# EAGLE design Seeeduino v4.0 (EAGLE 6.4)

## Sheet 1 of 2
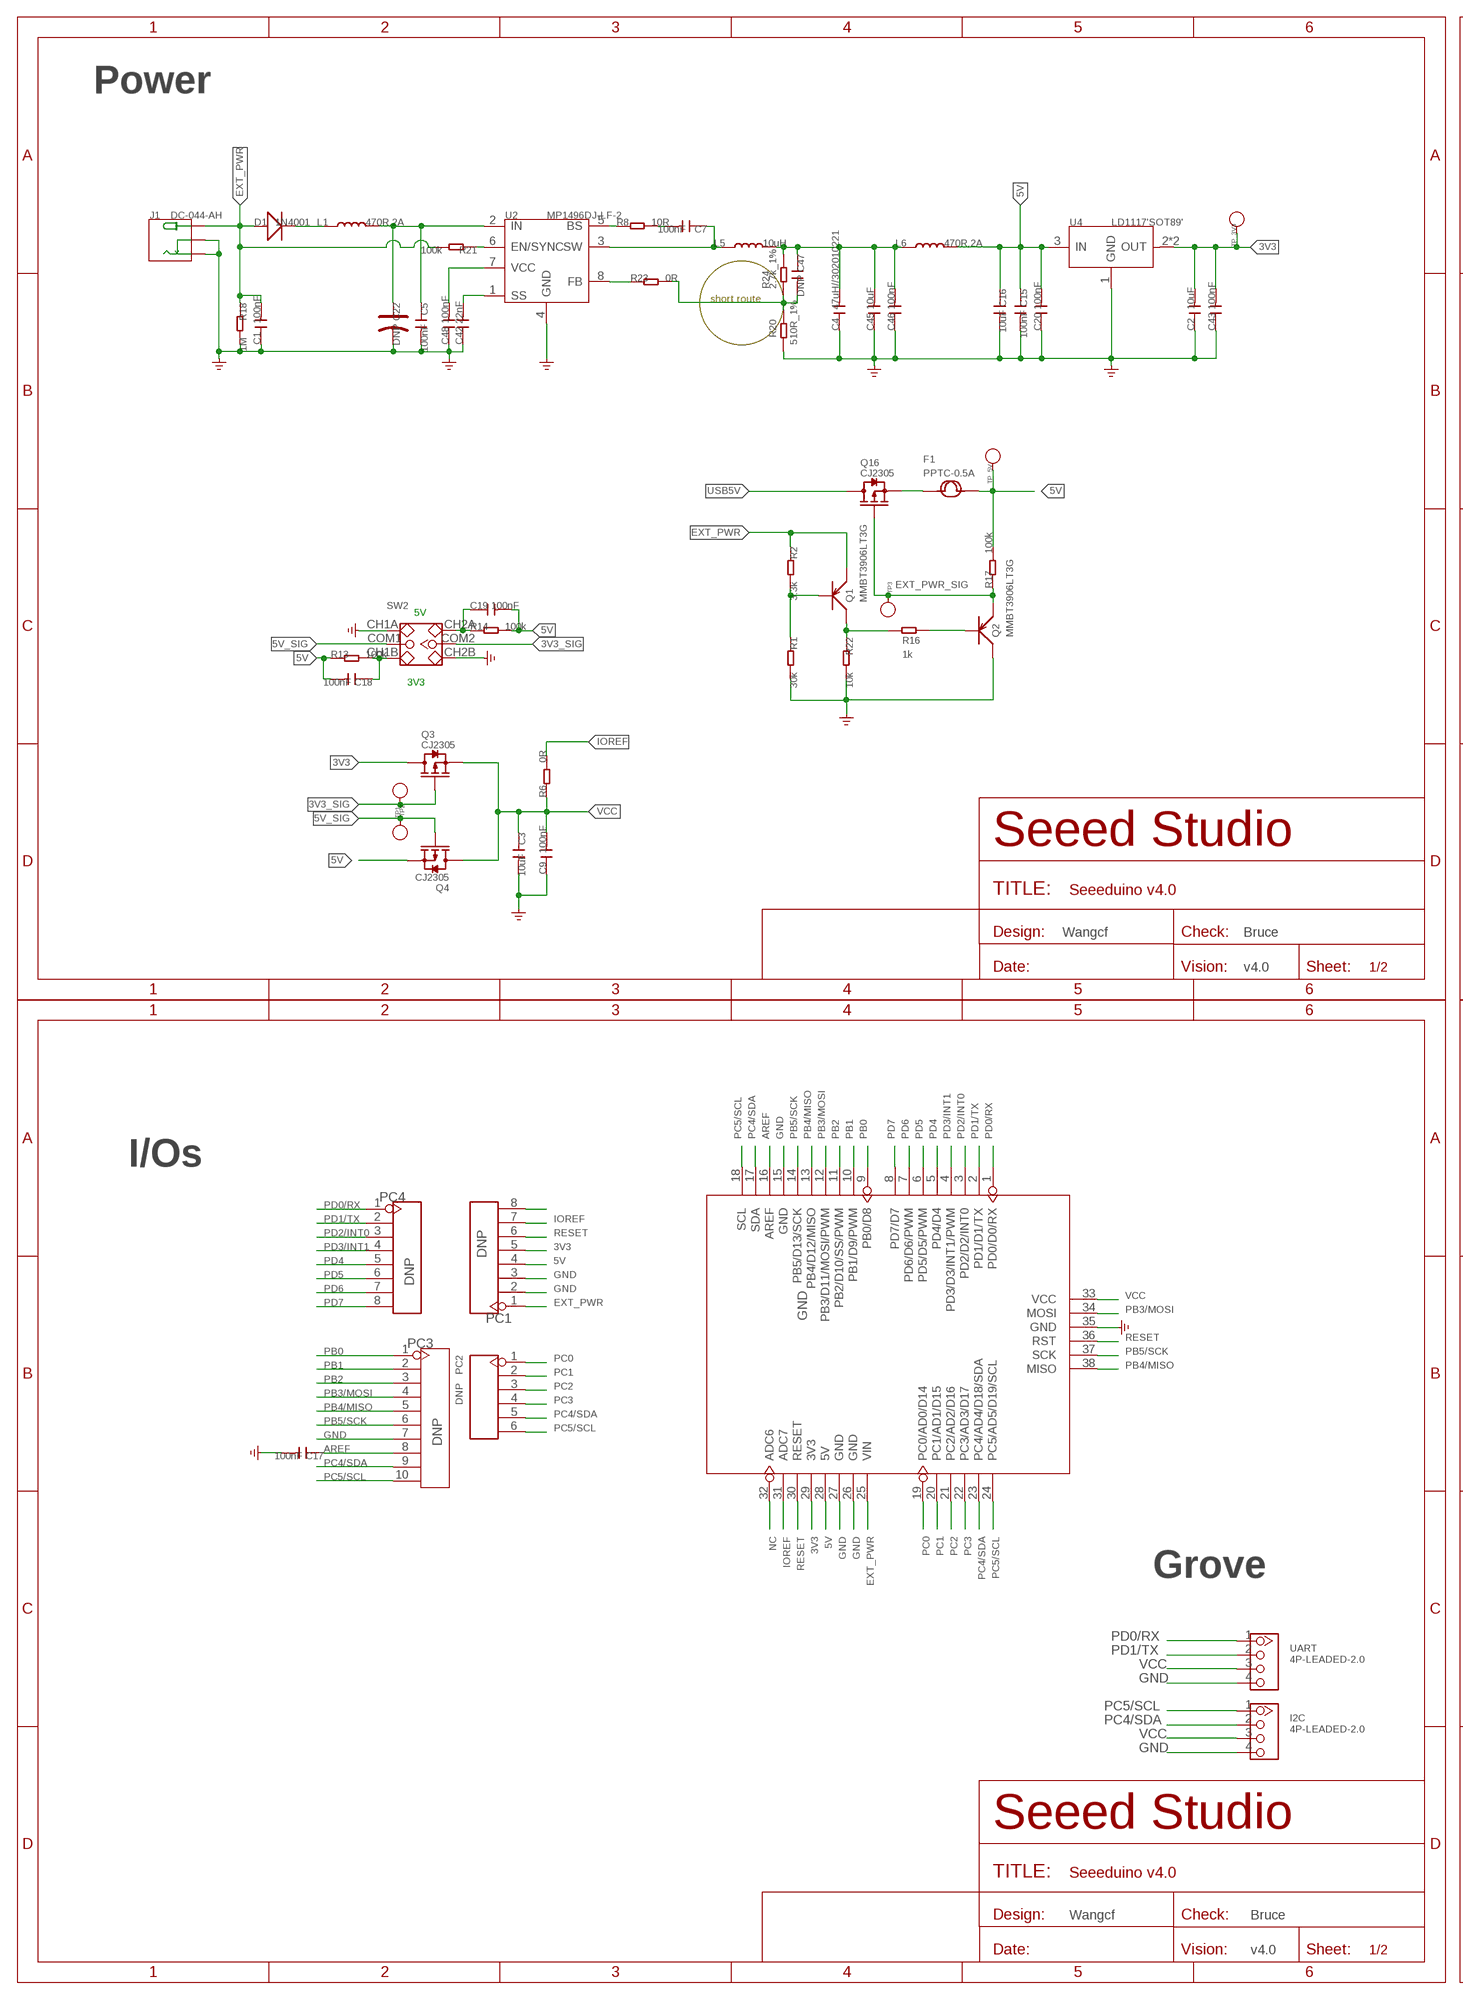
[diagram p0: schematic, sheet 1, part 1 of 2]
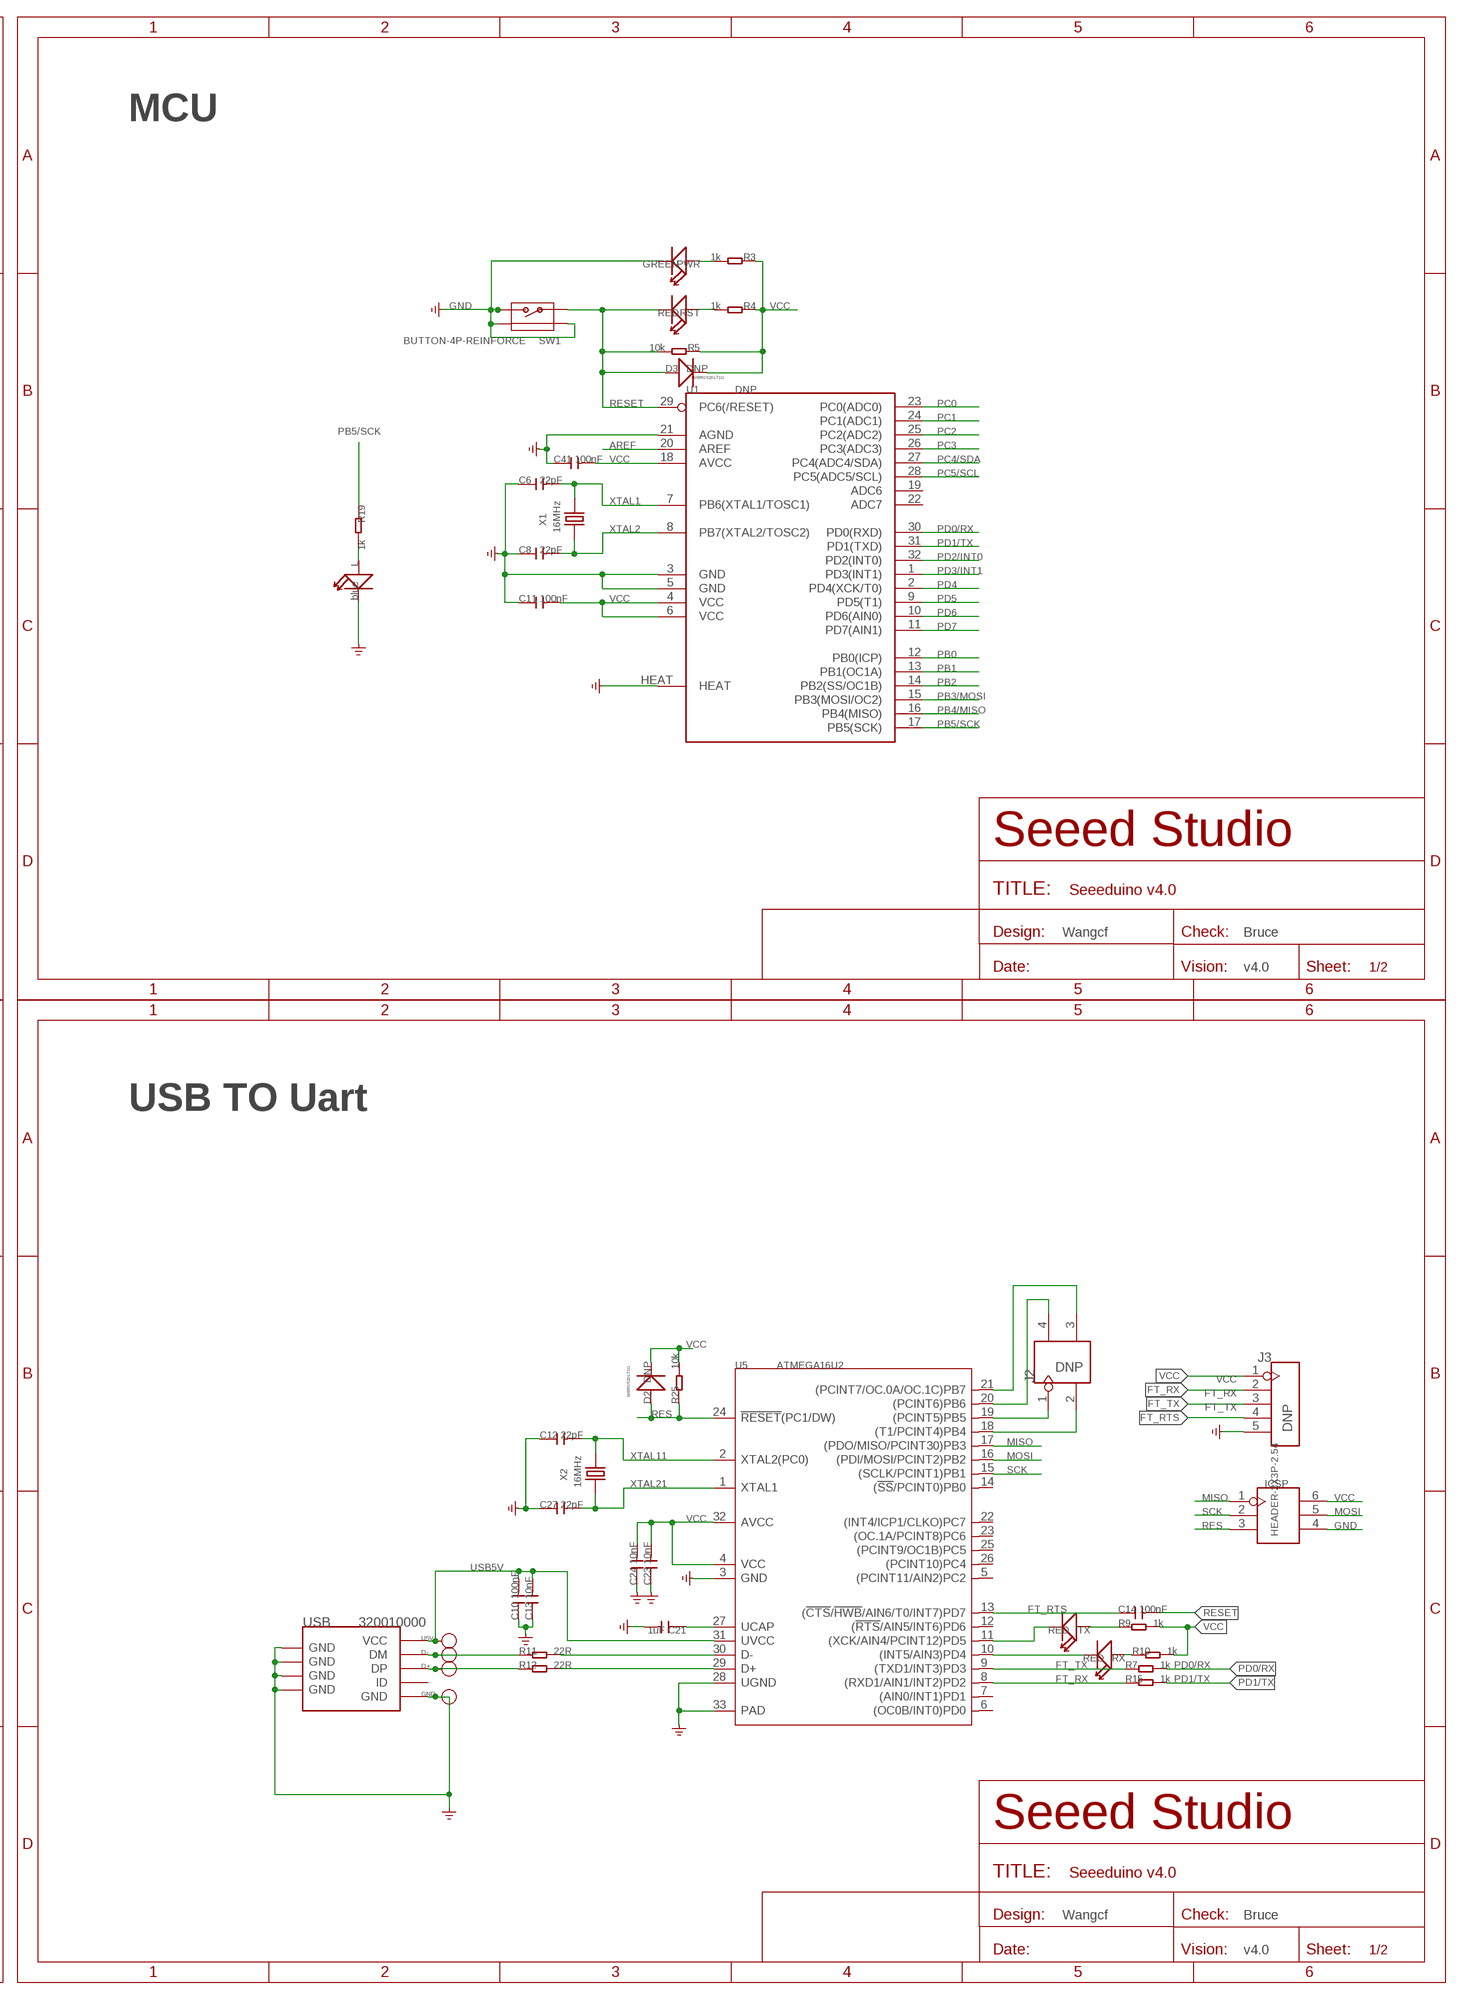
[diagram p1: schematic, sheet 1, part 2 of 2]

### Parts
C1  100nF  C-0603  [C0603]
C2  10uF  C-0805  [C0805]
C3  10uF  C-0805  [C0805]
C4  47uH//302010221  C-1206  [C1206]
C5  100nF  C-0603  [C0603]
C6  22pF  C-0603  [C0603]
C7  100nF  C-0603  [C0603]
C8  22pF  C-0603  [C0603]
C9  100nF  C-0603  [C0603]
C10  100nF  C-0603  [C0603]
C11  100nF  C-0603  [C0603]
C12  22pF  C-0603  [C0603]
C13  10nF  C-0603  [C0603]
C14  100nF  C-0603  [C0603]
C15  100nF  C-0603  [C0603]
C16  10uF  C-0805  [C0805]
C17  100nF  C-0603  [C0603]
C18  100nF  C-0603  [C0603]
C19  100nF  C-0603  [C0603]
C20  100nF  C-0603  [C0603]
C21  1uF  C-0603  [C0603]
C22  DNP  CAP-AVX-B  [AVX-B]
C23  10nF  C-0603  [C0603]
C24  10nF  C-0603  [C0603]
C27  22pF  C-0603  [C0603]
C41  100nF  C-0603  [C0603]
C42  22nF  C-0603  [C0603]
C43  100nF  C-0603  [C0603]
C45  10uF  C-0805  [C0805]
C46  100nF  C-0603  [C0603]
C47  DNP  C-0603  [C0603]
C48  100nF  C-0603  [C0603]
D1  1N4001  D'DO-214AC'  [D2010]
D2  DNP  D'1206'  [SOD123]
D3  DNP  D'1206'  [SOD123]
D+  PAD-TEST-POINT'4545'  [TP_4545]
D-  PAD-TEST-POINT'4545'  [TP_4545]
F1  PPTC-0.5A  FUSE'1206'  [F1206]
GND  PAD-TEST-POINT'4545'  [TP_4545]
I2C  4P-LEADED-2.0  TWIG-2.0-LEADED  [4P-LEADED-2.0]
ICSP  HEADER-2X3P-2.54  HEADER-2X3P-2.0  [2X3P-2.0]
J1  DC-044-AH  DC-044  [DC-404]
J2  DNP  HEADER-2X2P-2.54  [2X2P-2.54]
J3  DNP  HEADER-5P-2.54  [5P-2.54]
L  blue  LED'0603'  [LED-0603]
L1  470R,2A  L'0805'  [L0805]
L5  10uH  L'1813'  [1813]
L6  470R,2A  L'0805'  [L0805]
PC1  DNP  HEADER-8P-2.54  [8P-2.54]
PC2  DNP  HEADER-6P-65/35MIL  [6P-2.54-65/35MIL]
PC3  DNP  HEADER-10P-2.54  [10P-2.54]
PC4  DNP  HEADER-8P-2.54  [8P-2.54]
PWR  GREEN  LED'0603'  [LED-0603]
Q1  MMBT3906LT3G  TRANSISTOR-PNP-SOT23  [SOT23]
Q2  MMBT3906LT3G  TRANSISTOR-PNP-SOT23  [SOT23]
Q3  CJ2305  MOSFET-P'SI2323CDS/SI2305DS<BR>'  [SOT23]
Q4  CJ2305  MOSFET-P'SI2323CDS/SI2305DS<BR>'  [SOT23]
Q16  CJ2305  MOSFET-P'SI2323CDS/SI2305DS<BR>'  [SOT23]
R1  30k  R-0603  [R0603]
R2  3.3k  R-0603  [R0603]
R3  1k  R-0603  [R0603]
R4  1k  R-0603  [R0603]
R5  10k  R-0603  [R0603]
R6  0R  R-0603  [R0603]
R7  1k  R-0603  [R0603]
R8  10R  R-0603  [R0603]
R9  1k  R-0603  [R0603]
R10  1k  R-0603  [R0603]
R11  22R  R-0603  [R0603]
R12  22R  R-0603  [R0603]
R13  100k  R-0603  [R0603]
R14  100k  R-0603  [R0603]
R15  1k  R-0603  [R0603]
R16  1k  R-0603  [R0603]
R17  100k  R-0603  [R0603]
R18  1M  R-0603  [R0603]
R19  1k  R-0603  [R0603]
R20  510R_1%  R-0603  [R0603]
R21  100k  R-0603  [R0603]
R22  10k  R-0603  [R0603]
R23  0R  R-0603  [R0603]
R24  2.7k_1%  R-0603  [R0603]
R25  10k  R-0603  [R0603]
RST  RED  LED'0603'  [LED-0603]
RX  RED  LED'0603'  [LED-0603]
SW1  BUTTON-4P-REINFORCE  BUTTON-4P-REINFORCE'TS-1188E'  [4P-SMD-7X3.5X3.5H]
SW2  SWITCH-2CH-6P-2.54  SWITCH-2CH-6P-SMD  [6P-SMD-2CH-2.54-3.5X7.2]
TP1  PAD-TEST-POINT'4545'  [TP_4545]
TP2  PAD-TEST-POINT'4545'  [TP_4545]
TP3  PAD-TEST-POINT'4545'  [TP_4545]
TP_3V3  PAD-TEST-POINT'4545'  [TP_4545]
TP_5V  PAD-TEST-POINT'4545'  [TP_4545]
TX  RED  LED'0603'  [LED-0603]
U1  DNP  MEGA8  [MLF32X]
U2  MP1496DJ-LF-2  MP1496DJ  [TSOT23-8]
U3  ARDUINO-38P  [ARDUINO-38P]
U4  LD1117'SOT89'  [SOT89]
U5  ATMEGA16U2  [QFN32]
U5V  PAD-TEST-POINT'4545'  [TP_4545]
UART  4P-LEADED-2.0  TWIG-2.0-LEADED  [4P-LEADED-2.0]
USB  320010000  USB-MINIUSB-5P-MICRO  [MICRO-USB]
X1  16MHz  CRYSTAL'5032'  [2P-SMD-5X3.2]
X2  16MHz  CRYSTAL'5032'  [2P-SMD-5X3.2]

### Nets
3V3: C2.2 C43.2 PC1.5 Q3.3(D) TP_3V3.T U3.29(3V3) U4.2(OUT) U4.4(OUT)
3V3_SIG: Q3.1(G) SW2.COM2 TP1.T
5V: C15.1 C16.1 C18.2 C19.2 C20.2 F1.2 L6.2 PC1.4 Q4.2(S) R13.1 R14.2 R17.2 TP_5V.T U3.28(5V) U4.3(IN)
5V_SIG: Q4.1(G) SW2.COM1 TP2.T
AREF: C17.1 PC3.8 U1.20(AREF) U3.16(AREF)
D+: D+.T R12.1 USB.3(DP)
D-: D-.T R11.1 USB.2(DM)
EXT_PWR: C1.2 D1.+ J1.+ PC1.1 Q1.2(E) R2.1 R18.1 R21.2 U3.25(VIN)
EXT_PWR_SIG: Q2.2(E) Q16.1(G) R17.1 TP3.T
FT_RTS: C14.1 J3.4 U5.13((!CTS!/!HWB!/AIN6/T0/INT7)PD7)
FT_RX: J3.2 R15.1 U5.8((RXD1/AIN1/INT2)PD2)
FT_TX: J3.3 R7.1 U5.9((TXD1/INT3)PD3)
GND: C1.1 C2.1 C3.2 C4.1 C5.2 C6.1 C8.1 C9.1 C10.1 C11.1 C12.1 C13.1 C15.2 C16.2 C17.2 C20.1 C21.2 C22.- C23.1 C24.1 C27.1 C41.1 C42.1 C43.1 C45.1 C46.1 C48.1 GND.T I2C.4 ICSP.4 J1.- J1.CDN J3.5 L.- PC1.2 PC1.3 PC3.7 PWR.- Q2.3(C) R1.2 R18.2 R20.1 R22.2 SW1.2 SW1.S1 SW1.S2 SW2.CH1A SW2.CH2B U1.3(GND) U1.5(GND) U1.21(AGND) U1.HEAT U2.4(GND) U3.15(GND) U3.26(GND) U3.27(GND) U3.35(GND) U4.1(GND) U5.3(GND) U5.28(UGND) U5.33(PAD) UART.4 USB.5(GND) USB.S1(GND) USB.S2(GND) USB.S3(GND) USB.S4(GND) USB.S5(GND) USB.S6(GND)
IOREF: PC1.7 R6.2 U3.31(ADC7)
MISO: ICSP.1 U5.17((PDO/MISO/PCINT30)PB3)
MOSI: ICSP.5 U5.16((PDI/MOSI/PCINT2)PB2)
N$1: TX.- U5.11((XCK/AIN4/PCINT12)PD5)
N$3: L.+ R19.2
N$5: Q1.1(B) R1.1 R2.2
N$6: R11.2 U5.30(D-)
N$7: PWR.+ R3.2
N$8: Q2.1(B) R16.2
N$9: Q1.3(C) R16.1 R22.1
N$10: D1.- L1.1
N$11: C18.1 R13.2 SW2.CH1B
N$12: R10.1 RX.+
N$13: R12.2 U5.29(D+)
N$14: RX.- U5.10((INT5/AIN3)PD4)
N$15: C19.1 R14.1 SW2.CH2A
N$16: J2.1 U5.19((PCINT5)PB5)
N$17: R4.2 RST.+
N$18: C21.1 U5.27(UCAP)
N$19: R21.1 U2.6(EN/SYNC)
N$20: C48.2 U2.7(VCC)
N$21: C42.2 U2.1(SS)
N$22: R8.1 U2.5(BS)
N$23: C7.1 L5.1 U2.3(SW)
N$24: C7.2 R8.2
N$25: R23.1 U2.8(FB)
N$26: J2.2 U5.18((T1/PCINT4)PB4)
N$27: C47.2 R20.2 R23.2 R24.2
N$28: J2.4 U5.20((PCINT6)PB6)
N$29: J2.3 U5.21((PCINT7/OC.0A/OC.1C)PB7)
N$32: R9.1 TX.+
NC: PC1.8 U3.32(ADC6)
OUT1: C4.2 C45.2 C46.2 C47.1 L5.2 L6.1 R24.1
P5V [usbvcc]: F1.1 Q16.2(S)
PB0: PC3.1 U1.12(PB0(ICP)) U3.9(PB0/D8)
PB1: PC3.2 U1.13(PB1(OC1A)) U3.10(PB1/D9/PWM)
PB2: PC3.3 U1.14(PB2(SS/OC1B)) U3.11(PB2/D10/SS/PWM)
PB3/MOSI: PC3.4 U1.15(PB3(MOSI/OC2)) U3.12(PB3/D11/MOSI/PWM) U3.34(MOSI)
PB4/MISO: PC3.5 U1.16(PB4(MISO)) U3.13(PB4/D12/MISO) U3.38(MISO)
PB5/SCK: PC3.6 R19.1 U1.17(PB5(SCK)) U3.14(PB5/D13/SCK) U3.37(SCK)
PC0: PC2.1 U1.23(PC0(ADC0)) U3.19(PC0/AD0/D14)
PC1: PC2.2 U1.24(PC1(ADC1)) U3.20(PC1/AD1/D15)
PC2: PC2.3 U1.25(PC2(ADC2)) U3.21(PC2/AD2/D16)
PC3: PC2.4 U1.26(PC3(ADC3)) U3.22(PC3/AD3/D17)
PC4/SDA: I2C.2 PC2.5 PC3.9 U1.27(PC4(ADC4/SDA)) U3.17(SDA) U3.23(PC4/AD4/D18/SDA)
PC5/SCL: I2C.1 PC2.6 PC3.10 U1.28(PC5(ADC5/SCL)) U3.18(SCL) U3.24(PC5/AD5/D19/SCL)
PD0/RX: PC4.1 R7.2 U1.30(PD0(RXD)) U3.1(PD0/D0/RX) UART.1
PD1/TX: PC4.2 R15.2 U1.31(PD1(TXD)) U3.2(PD1/D1/TX) UART.2
PD2/INT0: PC4.3 U1.32(PD2(INT0)) U3.3(PD2/D2/INT0)
PD3/INT1: PC4.4 U1.1(PD3(INT1)) U3.4(PD3/D3/INT1/PWM)
PD4: PC4.5 U1.2(PD4(XCK/T0)) U3.5(PD4/D4)
PD5: PC4.6 U1.9(PD5(T1)) U3.6(PD5/D5/PWM)
PD6: PC4.7 U1.10(PD6(AIN0)) U3.7(PD6/D6/PWM)
PD7: PC4.8 U1.11(PD7(AIN1)) U3.8(PD7/D7)
PWR_IN: C5.1 C22.+ L1.2 U2.2(IN)
RES: D2.+ ICSP.3 R25.1 U5.24(!RESET!(PC1/DW))
RESET: C14.2 D3.+ PC1.6 R5.2 RST.- SW1.1 U1.29(PC6(/RESET)) U3.30(RESET) U3.36(RST)
SCK: ICSP.2 U5.15((SCLK/PCINT1)PB1)
USB5V: C10.2 C13.2 Q16.3(D) U5.31(UVCC) U5V.T USB.1(VCC)
VCC: C3.1 C9.2 C11.2 C23.2 C24.2 C41.2 D2.- D3.- I2C.3 ICSP.6 J3.1 Q3.2(S) Q4.3(D) R3.1 R4.1 R5.1 R6.1 R9.2 R10.2 R25.2 U1.4(VCC) U1.6(VCC) U1.18(AVCC) U3.33(VCC) U5.4(VCC) U5.32(AVCC) UART.3
XTAL1: C6.2 U1.7(PB6(XTAL1/TOSC1)) X1.2
XTAL2: C8.2 U1.8(PB7(XTAL2/TOSC2)) X1.1
XTAL11: C12.2 U5.2(XTAL2(PC0)) X2.2
XTAL21: C27.2 U5.1(XTAL1) X2.1
Unconnected: U1.19(ADC6) U1.22(ADC7) U5.5((PCINT11/AIN2)PC2) U5.6((OC0B/INT0)PD0) U5.7((AIN0/INT1)PD1) U5.12((!RTS!/AIN5/INT6)PD6) U5.14((!SS!/PCINT0)PB0) U5.22((INT4/ICP1/CLKO)PC7) U5.23((OC.1A/PCINT8)PC6) U5.25((PCINT9/OC1B)PC5) U5.26((PCINT10)PC4) USB.4(ID)

### Notes on the sheet
- Power
- MCU
- short route
- MBR0520LT1G
- 5V
- 3V3
- Wangcf | Bruce | Wangcf | Bruce
- v4.0 | v4.0
- USB TO Uart
- I/Os
- MBR0520LT1G
- Grove
- Wangcf | Bruce | Wangcf | Bruce
- v4.0 | v4.0

## Sheet 2 of 2
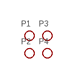
[diagram p2: schematic, sheet 2]

### Parts
P1  PAD-MARK  [ROUND-MARK-1.0]
P2  PAD-MARK  [ROUND-MARK-1.0]
P3  PAD-MARK  [ROUND-MARK-1.0]
P4  PAD-MARK  [ROUND-MARK-1.0]

## Library data of the parts
C1-C21 C23 C24 C27 C41-C43 C45-C48 = Discrete:C*: Ceramic Capacitors
C22 = Discrete:CAP*: Electrolytic Capacitors,Tantalum Capacitors and Super Capacitors
D1-D3 = Discrete:D*
D+ D- GND TP1-TP3 TP_3V3 TP_5V U5V = Discrete:PAD-TEST-POINT; PARTNO: DNP
F1 = Discrete:FUSE
I2C UART = Connector:TWIG-2.0-LEADED
ICSP = Connector:HEADER-2X3P
J1 = For_Test_Albert:DC-044
J2 = Connector:HEADER-2X2P
J3 = Connector:HEADER-5P
L PWR RST RX TX = Discrete:LED*
L1 L5 L6 = Discrete:L*
P1-P4 = Discrete:PAD-MARK; PARTNO: DNP
PC1 PC4 = Connector:HEADER-8P
PC2 = Connector:HEADER-6P
PC3 = Connector:HEADER-10P
Q1 Q2 = Discrete:TRANSISTOR-PNP*: PNP audion
Q3 Q4 Q16 = Discrete:MOSFET-P
R1-R25 = Discrete:R*
SW1 = Discrete:BUTTON-4P-REINFORCE: TS-1188E http://www.best-dz.com/?thread-374-2.html
SW2 = Discrete:SWITCH-2CH-6P
U1 = ICs_v54:MEGA8
U2 = template:MP1496DJ: High-Efficiency,2A，16V,500kHz Synchronous,Step-Down Converter http://html.alldatasheetcn.com/html-pdf/551584/MPS/MP1496DJ/55/1/MP1496DJ.html
U3 = moudle:ARDUINO-38P
U4 = IC:LD1117: Low Drop Fixed And Adjustable Positive Voltage Regulators http://www.datasheetcatalog.org/datasheet/SGSThomsonMicroelectronics/mXuqtqv.pdf
U5 = template2:ATMEGA16U2: 8-bit AVR Microcontroller with 8/16/32K Bytes of ISP Flash and USB Controller
USB = Connector:USB-MINIUSB-5P
X1 X2 = Discrete:CRYSTAL*: CRYSTAL

## Net classes
0 default: width 0.152 mm, clearance 0.152 mm
1 power: width 0.152 mm, drill 0.152 mm, clearance 0.152 mm
2 gnd: width 0.152 mm, drill 0.152 mm, clearance 0.152 mm
3 usbvcc: width 0.152 mm, drill 0.152 mm, clearance 0.152 mm

## Board
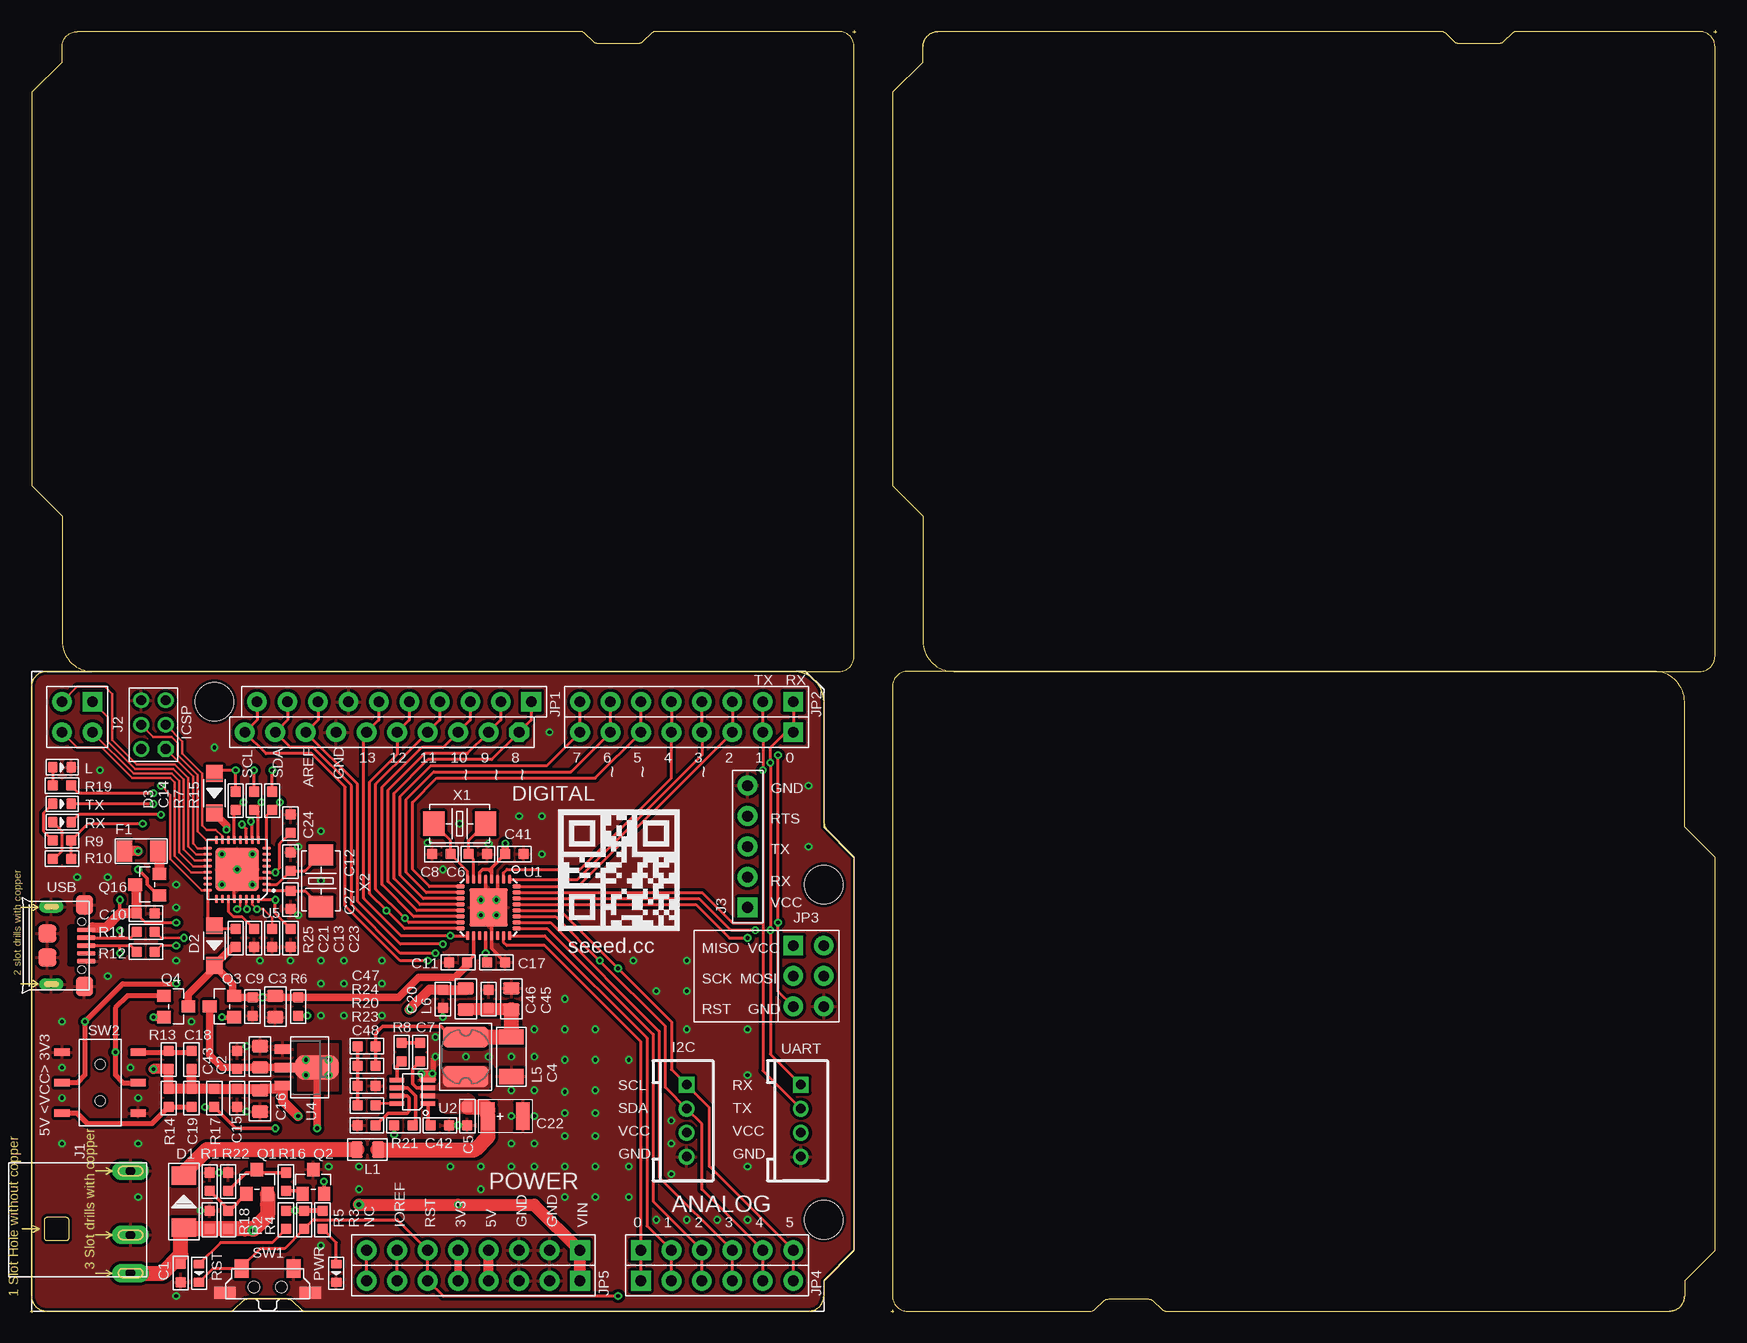
[diagram p3: board, top side]
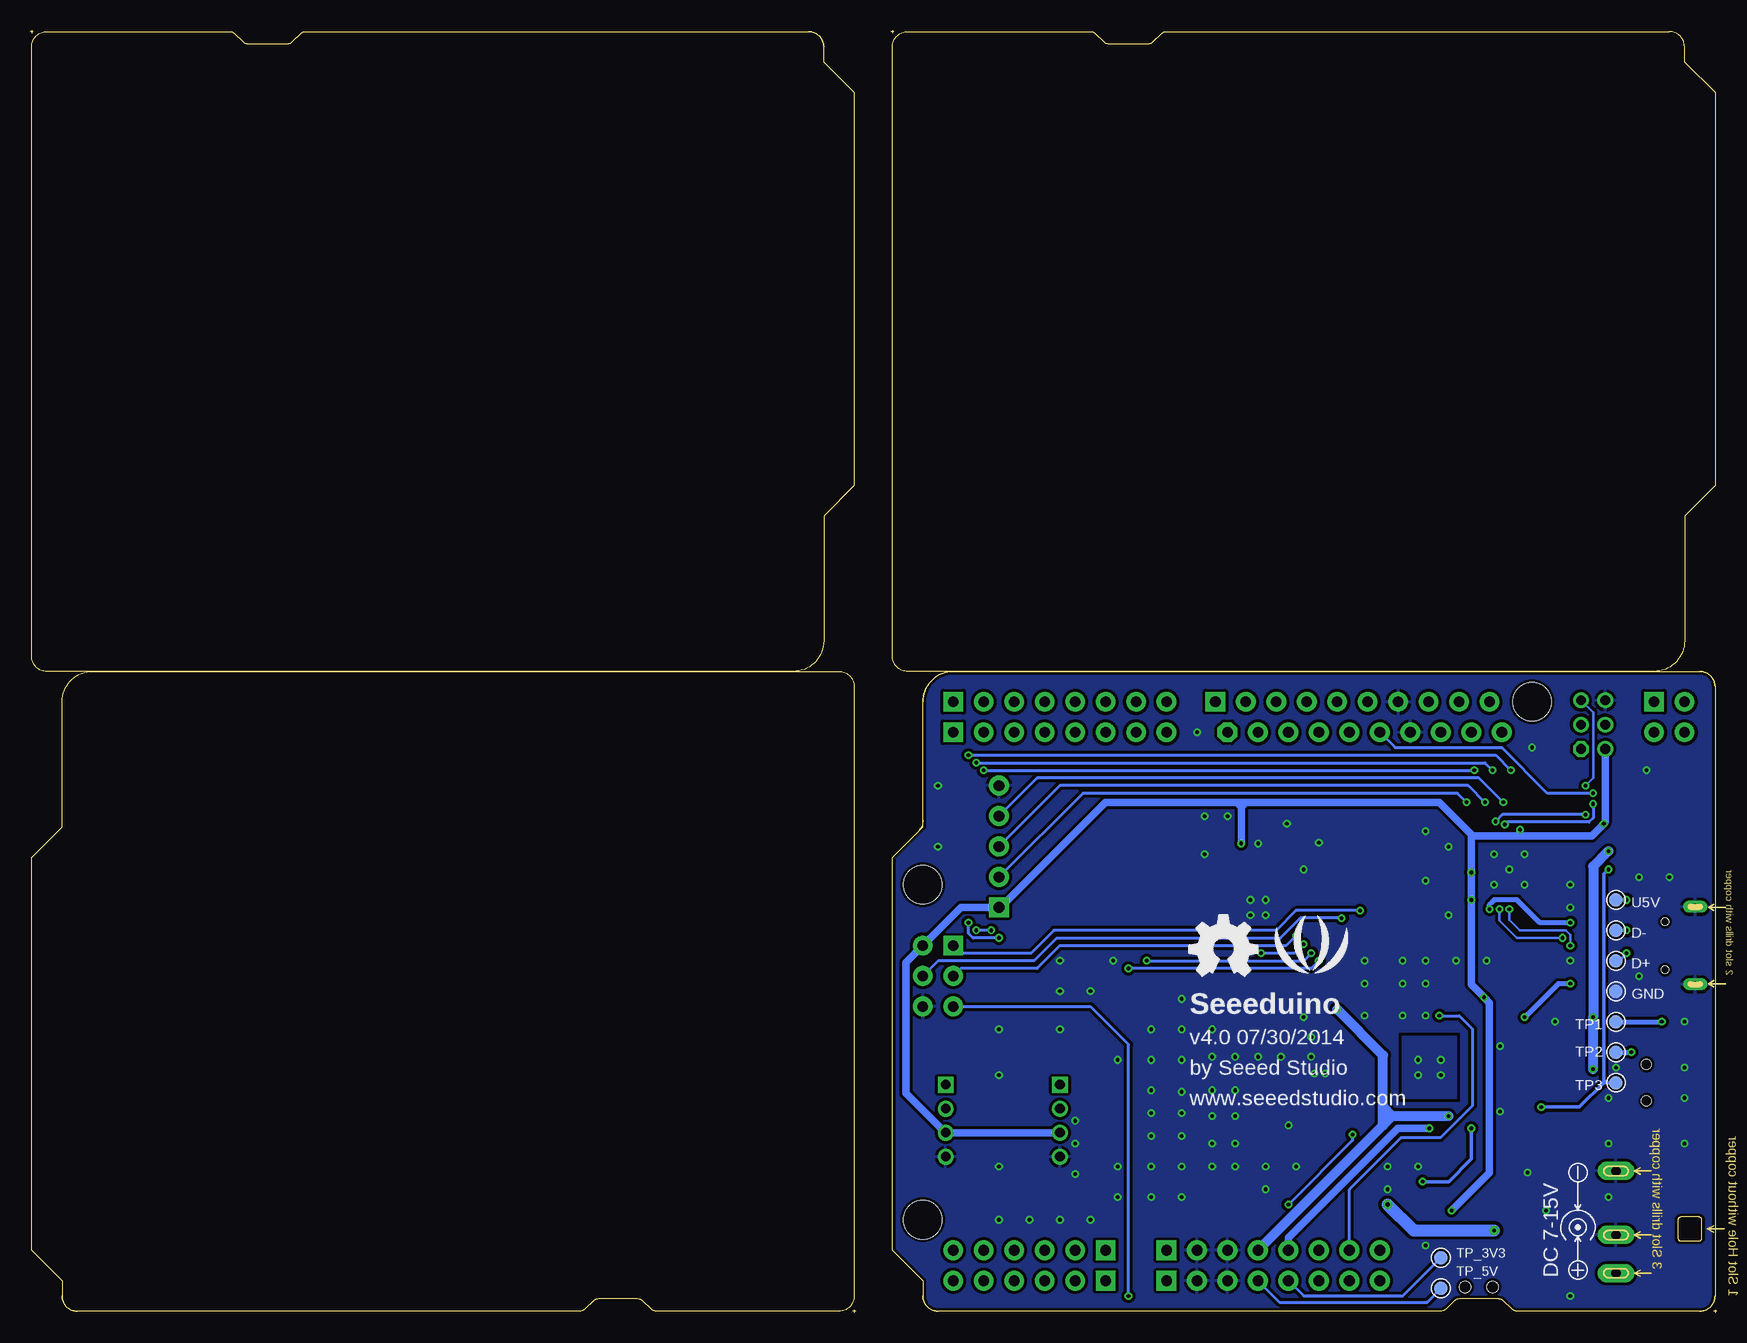
[diagram p4: board, bottom side, seen from below]

Size 140.59 x 106.93 mm. Coordinates in mm from the lower left corner, seen from the top.
Outline: 66.17,41.04 arc45 66.54,40.14 68.71,37.97
Outline: 68.71,5.21 66.54,3.04
Outline: 1.4,0.13 arc-90 0.13,1.4
Outline: 0.13,52.2 arc-90 1.4,53.47
Outline: 63.63,53.47 arc-90 66.17,50.93
Outline: 66.17,1.4 arc-90 64.9,0.13
Outline: 139.19,53.47 arc90 140.46,54.74
Outline: 140.46,105.54 arc90 139.19,106.81
Outline: 75.69,106.81 arc90 74.42,105.54
Outline: 74.42,56.01 arc90 76.96,53.47
Outline: 73.15,53.47 arc90 71.88,52.2
Outline: 137.92,50.93 arc90 135.38,53.47
Outline: 0.13,1.4 arc90 1.4,0.13
Outline: 64.9,0.13 arc90 66.17,1.4
Outline: 73.15,53.47 arc90 71.88,52.2
Outline: 71.88,1.4 arc90 73.15,0.13
Outline: 136.65,0.13 arc90 137.92,1.4
Outline: 137.92,50.93 arc90 135.38,53.47
Outline: 1.4,53.47 arc90 0.13,52.2
Outline: 0.13,1.4 arc90 1.4,0.13
Outline: 64.9,0.13 arc90 66.17,1.4
Outline: 66.17,50.93 arc90 63.63,53.47
Outline: 74.42,105.54 74.42,104.27 71.88,101.73 71.88,68.96 74.42,66.42 74.42,56.01
Outline: 74.42,105.54 arc-90 75.69,106.81
Outline: 76.96,53.47 139.19,53.47
Outline: 139.19,53.47 arc90 140.46,54.74
Outline: 140.46,54.74 140.46,105.54
Outline: 140.46,105.54 arc90 139.19,106.81
Outline: 74.42,56.01 arc90 76.96,53.47
Outline: 66.17,1.4 66.17,2.67 68.71,5.21
Outline: 66.17,1.4 arc-90 64.9,0.13
Outline: 63.63,53.47 1.4,53.47
Outline: 1.4,53.47 arc90 0.13,52.2
Outline: 0.13,52.2 0.13,1.4
Outline: 0.13,1.4 arc90 1.4,0.13
Outline: 68.71,5.21 68.71,37.97
Outline: 68.71,37.97 66.17,40.51 66.17,50.93
Outline: 66.17,50.93 arc90 63.63,53.47
Outline: 64.9,0.13 23,0.13 arc-45 22.55,0.31 21.9,0.96 arc45 21.45,1.14 18.17,1.14 arc45 17.72,0.96 17.08,0.31 arc-45 16.63,0.13 1.4,0.13
Outline: 137.92,1.4 137.92,2.67 140.46,5.21 140.46,37.97 137.92,40.51 137.92,50.93
Outline: 137.92,1.4 arc-90 136.65,0.13
Outline: 135.38,53.47 73.15,53.47
Outline: 73.15,53.47 arc90 71.88,52.2
Outline: 71.88,52.2 71.88,1.4
Outline: 71.88,1.4 arc90 73.15,0.13
Outline: 137.92,50.93 arc90 135.38,53.47
Outline: 0,0.13 0.25,0.13
Outline: 0.13,0.25 0.13,0
Outline: 71.75,0.13 72.01,0.13
Outline: 71.88,0.25 71.88,0
Outline: 68.58,106.81 68.83,106.81
Outline: 68.71,106.93 68.71,106.68
Outline: 140.34,106.81 140.59,106.81
Outline: 140.46,106.93 140.46,106.68
Outline: 136.65,0.13 94.75,0.13 arc-45 94.3,0.31 93.66,0.96 arc45 93.21,1.14 89.92,1.14 arc45 89.48,0.96 88.83,0.31 arc-45 88.38,0.13 73.15,0.13
Outline: 75.69,106.81 117.59,106.81 arc-45 118.04,106.62 118.69,105.98 arc45 119.13,105.79 122.42,105.79 arc45 122.87,105.98 123.51,106.62 arc-45 123.96,106.81 139.19,106.81
Outline: 2.67,104.27 2.67,105.54 arc-90 3.94,106.81 45.84,106.81 arc-45 46.29,106.62 46.93,105.98 arc45 47.38,105.79 50.66,105.79 arc45 51.11,105.98 51.76,106.62 arc-45 52.21,106.81 67.44,106.81 arc-90 68.71,105.54 68.71,54.74 arc-90 67.44,53.47 5.21,53.47 arc-90 2.67,56.01 2.67,66.42 0.13,68.96 0.13,101.73 2.67,104.27
Copper layers (1*16): Top 0.035mm / dielectric 1.5mm / Bottom 0.035mm
Design rules "SeeedStudio_2layer_DRU_no_angle_20140221 *": minimum track width 6mil, minimum drill 12mil, track to track 6mil, track to pad 6mil, pad to pad 6mil, via to via 6mil, smd to smd 0mil, copper to edge 10mil, drill to drill 10mil, minimum pad ring 10mil, minimum via ring 6mil, stop-mask expansion 2mil, vias tented up to drill 100mil, thermal gap 10mil
Holes 2.03 mm at 7.75,111.25 132.84,111.25 132.84,-4.32 7.75,-4.32

### Footprints (pad centres in the part's own frame; a part is rotated, then mirrored left to right if it is on the bottom)
C0603 = smd 0.889 x 0.889: 1 -0.762,0; 2 0.762,0
C0805 = smd 1.016 x 1.397: 1 -0.889,0; 2 0.889,0
C1206 = smd 1.27 x 2.032: 1 -1.651,0; 2 1.651,0
AVX-B = smd 1.143 x 2.286: + -1.46,0; - 1.46,0
D2010 = smd 1.524 x 2.032: + -2.159,0; - 2.159,0
SOD123 = smd 1.397 x 1.397: + -1.651,0; - 1.651,0
TP_4545 = smd 1.143 x 1.143: T 0,0
F1206 = smd 1.27 x 1.778: 1 -1.397,0; 2 1.397,0
4P-LEADED-2.0 = drill 0.8 pad 1.27 square: 1 -3,0 | drill 0.8 pad 1.27: 2 -1,0; 3 1,0; 4 3,0
2X3P-2.0 = drill 0.813 pad 1.27 octagon: 1 -1.016,2.032 | drill 0.813 pad 1.27: 2 -1.016,0; 3 -1.016,-2.032; 4 1.016,-2.032; 5 1.016,0; 6 1.016,2.032
DC-404 = drill 0.813 pad 1.524 long: + 3.175,10.16; - -5.334,10.16; CDN 0,10.16
2X2P-2.54 = drill 0.889 pad 1.651 square: 1 -1.27,1.27 | drill 0.889 pad 1.651: 2 -1.27,-1.27; 3 1.27,-1.27; 4 1.27,1.27
5P-2.54 = drill 0.889 pad 1.651 square: 1 0,5.08 | drill 0.889 pad 1.651: 2 0,2.54; 3 0,0; 4 0,-2.54; 5 0,-5.08
LED-0603 = smd 0.762 x 0.889: + -0.762,0; - 0.762,0
L0805 = smd 1.016 x 1.397: 1 -0.889,0; 2 0.889,0
1813 = smd 1.778 x 3.81: 1 -1.651,0; 2 1.651,0
ROUND-MARK-1.0 = smd 1.016 x 1.016: P$1 0,0
8P-2.54 = drill 0.889 pad 1.651 square: 1 0,8.89 | drill 0.889 pad 1.651: 2 0,6.35; 3 0,3.81; 4 0,1.27; 5 0,-1.27; 6 0,-3.81; 7 0,-6.35; 8 0,-8.89
6P-2.54-65/35MIL = drill 0.889 pad 1.651 square: 1 0,6.35 | drill 0.889 pad 1.651: 2 0,3.81; 3 0,1.27; 4 0,-1.27; 5 0,-3.81; 6 0,-6.35
10P-2.54 = drill 0.889 pad 1.651 octagon: 1 0,11.43 | drill 0.889 pad 1.651: 2 0,8.89; 3 0,6.35; 4 0,3.81; 5 0,1.27; 6 0,-1.27; 7 0,-3.81; 8 0,-6.35; 9 0,-8.89; 10 0,-11.43
SOT23 = smd 1.016 x 1.143: 1 -0.889,-1.016; 2 0.889,-1.016; 3 0,1.016
R0603 = smd 0.889 x 0.889: 1 -0.762,0; 2 0.762,0
4P-SMD-7X3.5X3.5H = smd 1.143 x 1.524: 1 -2.159,1.524; 2 2.159,1.524 | smd 1.778 x 1.016: S1 -3.556,-0.508; S2 3.556,-0.508 | hole 0.95: -1.15,0; 1.15,0
6P-SMD-2CH-2.54-3.5X7.2 = smd 1.27 x 0.635: CH1A -3.175,2.54; CH1B -3.175,-2.54; CH2A 3.175,2.54; CH2B 3.175,-2.54; COM1 -3.175,0; COM2 3.175,0 | hole 0.813: 0,1.524; 0,-1.524
MLF32X = smd 0.7 x 0.3: 1 -2.35,1.75; 2 -2.35,1.25; 3 -2.35,0.75; 4 -2.35,0.25; 5 -2.35,-0.25; 6 -2.35,-0.75; 7 -2.35,-1.25; 8 -2.35,-1.75; 17 2.35,-1.75; 18 2.35,-1.25; 19 2.35,-0.75; 20 2.35,-0.25; 21 2.35,0.25; 22 2.35,0.75; 23 2.35,1.25; 24 2.35,1.75 | smd 0.3 x 0.7: 9 -1.75,-2.35; 10 -1.25,-2.35; 11 -0.75,-2.35; 12 -0.25,-2.35; 13 0.25,-2.35; 14 0.75,-2.35; 15 1.25,-2.35; 16 1.75,-2.35; 25 1.75,2.35; 26 1.25,2.35; 27 0.75,2.35; 28 0.25,2.35; 29 -0.25,2.35; 30 -0.75,2.35; 31 -1.25,2.35; 32 -1.75,2.35 | smd 3.175 x 3.175: HEAT 0,0
TSOT23-8 = smd 0.4 x 1.2: 1 -0.975,-1.3; 2 -0.325,-1.3; 3 0.325,-1.3; 4 0.975,-1.3; 5 0.975,1.3; 6 0.325,1.3; 7 -0.325,1.3; 8 -0.975,1.3
ARDUINO-38P = drill 0.889 pad 1.651 square: 1 63.5,50.8; 9 41.656,50.8; 19 50.8,2.54; 25 45.72,2.54; 38 63.5,30.48 | drill 0.889 pad 1.651: 2 60.96,50.8; 3 58.42,50.8; 4 55.88,50.8; 5 53.34,50.8; 6 50.8,50.8; 7 48.26,50.8; 8 45.72,50.8; 10 39.116,50.8; 11 36.576,50.8; 12 34.036,50.8; 13 31.496,50.8; 14 28.956,50.8; 15 26.416,50.8; 16 23.876,50.8; 17 21.336,50.8; 18 18.796,50.8; 20 53.34,2.54; 21 55.88,2.54; 22 58.42,2.54; 23 60.96,2.54; 24 63.5,2.54; 26 43.18,2.54; 27 40.64,2.54; 28 38.1,2.54; 29 35.56,2.54; 30 33.02,2.54; 31 30.48,2.54; 32 27.94,2.54; 33 66.04,30.48; 34 66.04,27.94; 35 66.04,25.4; 36 63.5,25.4; 37 63.5,27.94 | hole 3.2: 15.24,50.8; 66.04,35.56; 66.04,7.62
SOT89 = smd 0.8 x 1.4: 1 -1.524,-1.905; 3 1.524,-1.905 | smd 0.8 x 1.9: 2 0,-1.651 | smd 2.032 x 3.65: 4 0,0.94
QFN32 = smd 0.7 x 0.25: 1 -2.45,1.75; 2 -2.45,1.25; 3 -2.45,0.75; 4 -2.45,0.25; 5 -2.45,-0.25; 6 -2.45,-0.75; 7 -2.45,-1.25; 8 -2.45,-1.75; 17 2.45,-1.75; 18 2.45,-1.25; 19 2.45,-0.75; 20 2.45,-0.25; 21 2.45,0.25; 22 2.45,0.75; 23 2.45,1.25; 24 2.45,1.75 | smd 0.25 x 0.7: 9 -1.75,-2.45; 10 -1.25,-2.45; 11 -0.75,-2.45; 12 -0.25,-2.45; 13 0.25,-2.45; 14 0.75,-2.45; 15 1.25,-2.45; 16 1.75,-2.45; 25 1.75,2.45; 26 1.25,2.45; 27 0.75,2.45; 28 0.25,2.45; 29 -0.25,2.45; 30 -0.75,2.45; 31 -1.25,2.45; 32 -1.75,2.45 | smd 3.6 x 3.6: 33 0,0
MICRO-USB = smd 0.381 x 1.524: 1 -1.3,-0.25; 2 -0.65,-0.25; 3 0,-0.25; 4 0.65,-0.25; 5 1.3,-0.25 | smd 1.6 x 1.397: S1 -3.4,-0.427; S6 3.4,-0.427 | drill 0.508 pad 1.016 long: S2 -3.226,-3.175; S5 3.226,-3.175 | smd 1.5 x 1.5: S3 -1,-3.5; S4 1,-3.5 | hole 0.635: -2,-0.65; 2,-0.65
2P-SMD-5X3.2 = smd 1.778 x 2.032: 1 -2.159,0; 2 2.159,0

### Placement (x,y rotation side)
C1  12.57,3.3 90 top
C2  19.18,21.34 270 top
C3  20.45,25.53 270 top
C4  40.13,21.34 90 top
C5  36.45,16.38 270 top
C6  37.34,38.23 180 top
C7  32.51,21.72 90 top
C8  34.29,38.23 0 top
C9  18.54,25.53 90 top
C10  9.65,33.27 180 top
C11  35.69,29.21 0 top
C12  21.72,37.59 270 top
C13  20.19,31.24 90 top
C14  17.14,42.67 90 top
C15  17.27,17.91 270 top
C16  19.18,17.65 270 top
C17  38.86,29.21 0 top
C18  13.46,21.08 270 top
C19  13.46,17.91 90 top
C20  34.42,26.16 90 top
C21  18.67,31.24 270 top
C22  39.62,16.38 0 top
C23  21.72,31.24 90 top
C24  21.72,40.77 270 top
C27  21.72,34.42 90 top
C41  40.39,38.23 180 top
C42  34.16,15.62 180 top
C43  17.27,21.08 270 top
C45  40.13,26.16 270 top
C46  38.23,26.16 270 top
C47  28.07,22.22 180 top
C48  28.07,15.62 0 top
D1  12.83,9.27 90 top
D2  15.37,30.61 270 top
D3  15.37,43.31 270 top
D+  8.38,29.34 0 bottom
D-  8.38,31.88 0 bottom
F1  9.27,38.48 180 top
GND  8.38,26.8 0 bottom
I2C  54.74,16 270 top
ICSP  10.29,49.02 180 top
J1  -1.78,6.48 270 top
J2  3.94,49.66 270 top
J3  59.82,38.86 180 top
L  2.67,45.47 0 top
L1  28.13,13.59 0 top
L5  36.32,21.34 90 top
L6  36.32,26.16 90 top
P1  2.67,-4.32 0 top  (outside the outline)
P2  137.92,-4.32 0 top  (outside the outline)
P3  2.67,111.25 0 top  (outside the outline)
P4  137.92,111.25 0 top  (outside the outline)
PC1  36.96,5.21 270 top
PC2  57.28,5.21 90 top
PC3  29.34,48.39 270 top
PC4  54.74,48.39 270 top
PWR  25.53,3.3 270 top
Q1  18.92,10.92 0 top
Q2  23.62,10.92 0 top
Q3  16,25.53 90 top
Q4  12.19,25.53 270 top
Q16  9.78,35.69 90 top
R1  14.99,10.92 90 top
R2  16.51,7.75 90 top
R3  24.38,7.75 270 top
R4  21.34,7.75 270 top
R5  22.86,7.75 270 top
R6  22.35,25.53 270 top
R7  18.67,42.67 90 top
R8  30.99,21.72 90 top
R9  2.67,39.37 0 top
R10  2.67,37.85 0 top
R11  9.65,31.75 0 top
R12  9.65,30.1 0 top
R13  11.56,21.08 90 top
R14  11.56,17.91 90 top
R15  20.19,42.67 90 top
R16  21.34,10.92 270 top
R17  15.37,17.91 90 top
R18  14.99,7.75 90 top
R19  2.67,43.94 180 top
R20  28.07,18.92 180 top
R21  31.11,15.62 180 top
R22  16.51,10.92 90 top
R23  28.07,17.27 180 top
R24  28.07,20.57 180 top
R25  17.14,31.24 270 top
RST  14.1,3.3 270 top
RX  2.67,40.89 0 top
SW1  19.81,2.16 0 top
SW2  5.84,19.18 180 top
TP1  8.38,24.26 0 bottom
TP2  8.38,21.72 0 bottom
TP3  8.38,19.18 0 bottom
TP_3V3  22.99,4.57 0 bottom
TP_5V  22.99,2.03 0 bottom
TX  2.67,42.42 0 top
U1  38.23,33.78 270 top
U2  31.88,18.41 90 top
U3  0.13,0.13 0 top
U4  22.99,20.45 270 top
U5  17.27,36.96 180 top
U5V  8.38,34.42 0 bottom
U$2  [SEEED_MASK]  -11.05,57.02 0 top  (outside the outline)
U$4  [LOGO_SILK]  33.78,29.97 0 bottom
U$5  [OSHW_FILLX200_NOTEXT]  43.94,28.07 0 bottom
UART  64.26,16 270 top
USB  4.95,30.61 270 top
X1  35.81,40.77 0 top
X2  24.26,36 90 top

### Tracks (layer width: path | path; a pad name or v marks a point on that pad's centre or on a via)
3V3  (via drill 0.3 pad 0.64)
  Top 0.61: 17.4,20.45 C2.2 U4.2 U4.4 23.94,20.43 v23.94,15.37 | 17.4,20.45 C43.2 | U3.29 PC1.5 | 17.4,20.45 16,20.45 14.99,21.46 Q3.3
  Bottom 0.254: U3.29 34.42,1.4 26.16,1.4 TP_3V3.T
  Bottom 0.61: v23.94,15.37 26.56,15.37 35.69,6.24 PC1.5
  other vias: 22.99,21.08 24.89,21.08 24.89,19.81 22.99,19.81
  pour Top (isolate 0.254, no thermals): 22.35,22.35 25.65,22.35 25.65,18.54 22.35,18.54
  pour Bottom (isolate 0.254, no thermals): 21.72,22.99 26.16,22.99 26.16,17.91 21.72,17.91
3V3_SIG  (via drill 0.3 pad 0.64)
  Top 0.406: SW2.COM2 3.94,19.18 4.57,19.81 v4.57,24.26 7.75,27.43 v12.19,27.43 | v16,24.64 Q3.1
  Bottom 0.406: TP1.T v4.57,24.26 | v12.19,27.43 13.21,27.43 v16,24.64
5V  (via drill 0.3 pad 0.64)
  Top 0.61: 11.17,24.57 11.18,24.58 Q4.2 v10.29,24.64
  Top 0.813: U3.28 PC1.4 | 21.08,18.8 U4.3 | 19.3,18.67 C15.1 R17.2 C19.2 | 21.08,18.8 20.95,18.67 19.3,18.67 | 19.3,18.67 C16.1 | C19.2 R14.2 R13.1 v10.29,20.32 | C19.2 C18.2 | v9.02,38.48 F1.2 | L6.2 36.45,26.92 C20.2 33.27,26.92 v31.62,25.27 | 21.08,18.8 21.08,17.65 v22.35,16.38
  Bottom 0.254: U3.28 36.45,0.89 24.13,0.89 TP_5V.T
  Bottom 0.813: v10.29,20.32 v10.29,24.64 10.29,37.21 v9.02,38.48 | PC1.4 27.81,15.62 | 27.81,15.62 27.05,16.38 | v22.35,16.38 27.05,16.38 | 27.81,15.62 27.81,17.14 | 27.81,17.14 27.81,21.46 v31.62,25.27 | 27.05,16.38 27.81,17.14
5V_SIG  (via drill 0.3 pad 0.64)
  Top 0.406: SW2.COM1 7.75,19.18 7.11,19.81 v7.11,21.72 7.11,25.4 8.13,26.42 Q4.1
  Bottom 0.406: TP2.T v7.11,21.72
AREF  (via drill 0.3 pad 0.64)
  Top 0.203: 37.98,29.34 37.98,29.33 C17.1
  Top 0.254: v34.42,30.73 30.86,30.73 27.3,34.29 27.3,44.07 PC3.8 24,49.4 U3.16
  Top 0.305: U1.20 v37.98,29.98 37.98,29.34
  Bottom 0.254: v37.98,29.98 35.17,29.98 v34.42,30.73
D+  (via drill 0.3 pad 0.64)
  Top 0.254: USB.3 7.49,30.61 | 7.49,30.61 8.38,30.61 R12.1 | v7.49,29.97 7.49,30.61
  Bottom 0.254: D+.T 8.13,29.34 v7.49,29.97
D-  (via drill 0.3 pad 0.64)
  Top 0.254: USB.2 7.49,31.26 | 7.49,31.26 8.4,31.26 R11.1 8.76,31.75 8.7,31.81 | v7.49,31.88 7.49,31.26
  Bottom 0.254: D-.T v7.49,31.88
EXT_PWR  (via drill 0.3 pad 0.64, 0.3 pad 0.81, 0.38 pad 0.81)
  Top 0.254: 19.81,9.02 19.81,8.13 19.74,8.05 | R21.2 v30.35,14.86 | 12.57,4.83 C1.2
  Top 0.406: D1.+ 12.7,7.11
  Top 1.016: U3.25 PC1.1 42.04,9.02 v35.69,9.02 v27.43,9.02 | 17.91,6.86 v18.54,6.86 18.54,6.98
  Top 1.27: 12.7,7.11 12.65,7.06 arc45 12.57,6.88 12.57,4.83 11.05,3.3 J1.+ | D1.+ 12.88,7.06 arc45 13.06,6.98 R18.1 R2.1 18.54,6.98 18.67,6.98 19.74,8.05 arc45 19.81,8.23 19.81,9.02 Q1.2
  Bottom 0.254: v30.35,14.86 30.35,14.35 v35.69,9.02
  Bottom 1.016: v27.43,9.02 25.27,6.86 v18.54,6.86
EXT_PWR_SIG  (via drill 0.3 pad 0.64)
  Top 0.305: v14.61,17.14 R17.1 17.14,15.37 v20.45,15.37 | Q2.2 v24.51,10.92 | v9.02,36.96 9.78,36.2 9.78,35.69 10.67,34.8 Q16.1
  Bottom 0.305: 9.4,19.43 9.4,19.18 | v14.61,17.14 11.43,17.14 9.4,19.18 | 9.4,19.18 9.14,19.18 | 9.14,19.18 TP3.T | v24.51,10.92 22.33,10.92 20.45,12.81 v20.45,15.37 | 9.4,19.43 9.14,19.18 | 9.4,19.43 9.4,36.58 v9.02,36.96
FT_RTS  (via drill 0.3 pad 0.64)
  Top 0.254: U5.13 17.02,41.79 C14.1 17.27,42.04 v17.78,42.55
  Bottom 0.254: J3.4 56.64,44.58 19.81,44.58 v17.78,42.55
FT_RX  (via drill 0.3 pad 0.64)
  Top 0.254: U5.8 19.72,41.44 R15.1 v20.83,42.55
  Bottom 0.254: J3.2 52.83,43.31 21.59,43.31 v20.83,42.55
FT_TX  (via drill 0.3 pad 0.64)
  Top 0.254: U5.9 19.02,41.76 18.82,41.76 R7.1 v19.3,42.55
  Bottom 0.254: J3.3 54.74,43.94 20.7,43.94 v19.3,42.55
GND  (via drill 0.3 pad 0.64)
  Top 0.254: U5.3 18.02,36.21 U5.33 17.02,36.71 U5.28
  Top 0.305: U1.3 38.98,34.53 v38.86,34.42 | U1.5 37.98,34.8 v37.59,34.42 38.1,33.91 38.1,33.78 U1.HEAT | v38.86,33.15 38.48,32.76 U1.21 38.48,30.36 C17.2
  Top 0.406: 32.64,19.68 v32.64,19.94 v33.53,19.94 33.53,19.68 | 32.64,19.68 32.64,19.43 33.53,19.43 | 33.53,19.43 33.53,19.68 | 32.64,19.68 33.53,19.68 | 33.53,19.43 33.66,19.43 33.66,21.21 v33.78,21.34
  other vias: 37.59,33.15 33.15,39.18 38.23,39.12 42.67,38.23 40.77,41.4 35.69,15.62 15.75,11.68 14.22,8.51 18.03,16.76 12.19,1.4 24.26,5.59 6.48,28.07 9.02,17.91 18.03,22.22 24.26,24.77 26.16,24.77 24.89,12.19 27.43,12.19 40.13,18.54 42.04,18.54 44.58,18.41 44.58,16.64 42.04,16.38 40.13,16.38 40.13,14.1 42.04,14.1 44.58,14.73 42.04,23.62 42.04,21.34 44.58,21.08 44.58,23.62 21.72,29.34 29.34,29.34 19.18,29.34 42.67,41.4 54.74,23.62 59.82,19.81 59.82,23.62 59.82,12.19 59.82,7.75 57.28,7.75 54.74,7.75 52.2,7.75 2.67,24.26 2.67,20.45 2.67,17.91 2.67,14.1 9.02,14.1 9.02,9.65 35.05,12.19 37.59,12.19 44.58,12.19 42.04,12.19 40.13,12.19 47.12,18.54 47.12,16.64 47.12,14.73 47.12,12.19 47.12,9.65 44.58,9.65 13.46,24.26 8.38,20.45 47.12,21.08 33.78,22.99 36.32,21.34 40.13,21.34 38.23,21.34 34.42,24.64 16,38.23 18.54,38.23 18.54,35.69 16,35.69 17.27,36.96 12.19,33.78 12.19,35.69 24.26,40.13 26.16,29.34 24.26,29.34 12.19,29.34 6.48,36.32 3.94,36.32 15.37,47.12 34.42,36.96 35.81,40.77 24.26,36 22.35,38.86 22.35,33.15 29.34,24.77 27.43,10.29 37.59,10.29 24.26,27.43 29.34,27.43 26.16,27.43 5.84,45.21 49.91,9.65 49.91,12.19 49.91,21.08 47.12,23.62 44.58,26.16 50.29,29.34 54.74,29.34 54.74,26.8 52.2,26.8 53.47,16 53.47,14.1 53.47,11.56 64.9,43.94 64.9,38.86 43.31,48.39
  pour Top (isolate 0.254, rank 6): 0.13,53.47 68.71,53.47 68.71,0.13 0.13,0.13
  pour Bottom (isolate 0.254, rank 6): 0.13,53.47 68.71,53.47 68.71,0.13 0.13,0.13
IOREF  (via drill 0.3 pad 0.64)
  Top 0.254: U3.31 PC1.7 | R6.2 v23.11,24.77
  Bottom 0.254: PC1.7 30.61,10.29 26.29,14.61 22.99,14.61 20.32,17.27 20.32,23.62 21.46,24.77 v23.11,24.77
MISO
  Top 0.203: U5.17 14,38.71 13.59,39.12 13.59,44.7 ICSP.1
MOSI
  Top 0.203: U5.16 14.7,39.41 13.97,40.13 13.97,44.83 12.32,46.48 12.32,47.5 11.81,48.01 10.29,48.01 ICSP.5
N$1  (via drill 0.3 pad 0.64)
  Top 0.254: v10.29,42.42 TX.- | U5.11 18.02,40.34 v17.65,40.7
  Bottom 0.254: v10.29,42.42 10.29,41.25 10.65,40.89 17.46,40.89 v17.65,40.7
N$3
  Top 0.254: L.+ R19.2
N$5
  Top 0.305: R1.1 16.51,8.64 R2.2 16.64,8.51 Q1.1
N$6  (via drill 0.3 pad 0.64)
  Top 0.203: U5.30 18.02,33.73 v18.1,33.66 | v12.83,31.24 10.92,31.24 R11.2
  Bottom 0.203: v12.83,31.24 16.64,31.24 18.1,32.7 v18.1,33.66
N$7
  Top 0.254: PWR.+ 25.53,5.84 R3.2
N$8
  Top 0.305: R16.2 22.48,10.16 Q2.1
N$9
  Top 0.305: R16.1 18.92,11.68 | 18.92,11.68 Q1.3 | 18.92,11.68 18.03,11.68 R22.1
N$10
  Top 1.27: D1.- 12.83,11.58 | 12.83,11.58 arc-45 12.9,11.76 | L1.1 14.73,13.59 12.83,11.68 12.83,11.58
N$11
  Top 0.406: SW2.CH1B 11.43,21.72 | 11.43,21.72 R13.2 | 11.43,21.72 13.34,21.72 C18.1
N$12
  Top 0.254: R10.1 2.03,37.85 2.67,38.48 2.67,40.13 RX.+
N$13  (via drill 0.3 pad 0.64)
  Top 0.203: U5.29 17.52,33.91 v17.27,33.66 | v12.19,30.61 10.92,30.61 R12.2
  Bottom 0.203: v12.19,30.61 12.19,31.5 12.57,31.88 16.38,31.88 17.27,32.77 v17.27,33.66
N$14  (via drill 0.3 pad 0.64)
  Top 0.254: U5.10 18.52,40.85 v18.41,40.96 | v10.92,41.53 4.06,41.53 RX.-
  Bottom 0.254: v10.92,41.53 17.84,41.53 v18.41,40.96
N$15
  Top 0.406: 13.59,17.14 C19.1 R14.1 10.16,15.75 4.83,15.75 3.94,16.64 SW2.CH2A
N$16
  Top 0.203: J2.1 6.48,49.66 6.48,47.62 8.76,45.34 11.94,45.34 12.83,44.45 12.83,38.61 13.73,37.71 U5.19
N$17
  Top 0.254: R4.2 20.19,5.84 15.88,5.84 RST.+
N$18
  Top 0.254: U5.27 16.52,33.45 16.95,33.02 17.65,33.02 C21.1
N$19
  Top 0.305: U2.6 31.47,18.74 32.13,18.07 32.13,15.62 R21.1
N$20
  Top 0.305: U2.7 31.44,18.09 31.62,17.91 31.62,16.82 31.44,16.64 29.84,16.64 C48.2
N$21
  Top 0.305: U2.1 33.18,15.85 C42.2
N$22
  Top 0.254: U2.5 30.58,19.4 30.61,19.43
  Top 0.305: 30.82,19.39 30.65,19.39 30.61,19.43 30.61,20.57 R8.1
N$23
  Top 0.305: 34.67,20.32 35.69,20.32 L5.1 | C7.1 31.88,20.32 31.88,19.07 32.21,18.74 U2.3
  pour Top (isolate 0.203, no thermals): 32.58,18.61 37.85,18.61 arc90 38.48,19.24 38.48,19.88 arc90 37.85,20.51 34.8,20.51 arc90 34.16,19.88 34.16,19.3 arc-90 33.91,19.05 32.58,19.05
N$24
  Top 0.305: R8.2 C7.2
N$25
  Top 0.203: U2.8 29,17.44 R23.1
N$26
  Top 0.203: U5.18 13.86,38.21 13.21,38.86 13.21,44.58 12.07,45.72 8.89,45.72 6.86,47.75 6.86,51.56 6.22,52.2 3.94,52.2 J2.2
N$27
  Top 0.305: R23.2 R20.2 R24.2 C47.2
N$28
  Top 0.203: U5.20 13.59,37.21 12.45,38.35 12.45,44.32 11.81,44.96 8.64,44.96 J2.4
N$29
  Top 0.203: U5.21 13.46,36.71 12.07,38.1 12.07,44.2 11.68,44.58 8.51,44.58 5.97,47.12 3.94,47.12 J2.3
N$32
  Top 0.254: R9.1 1.14,40.13 1.14,41.66 TX.+
NC
  Top 0.254: U3.32 PC1.8
OUT1
  Top 0.305: R24.1 C47.1 28.83,23.31 29.4,23.88 34.29,23.88 35.18,22.99 L5.2 | C46.2 38.1,25.27
  Top 1.016: C45.2 38.1,25.27 L6.1
  Top 1.27: L5.2 C4.2 C45.2
P5V
  Top 0.813: F1.1 10.67,38.35 10.79,38.23 Q16.2
PB0
  Top 0.254: U1.12 32.52,34.03 30.35,36.2 30.35,43.31 33.15,46.1 38.48,46.1 PC3.1 41.78,49.4 U3.9
PB1
  Top 0.254: U1.13 32.25,33.53 29.84,35.94 29.84,43.56 32.89,46.61 36.45,46.61 PC3.2 39.24,49.4 U3.10
PB2
  Top 0.254: U1.14 31.99,33.03 29.34,35.69 29.34,43.82 32.64,47.12 34.42,47.12 PC3.3 36.7,49.4 U3.11
PB3/MOSI  (via drill 0.3 pad 0.64)
  Top 0.254: U1.15 31.6,32.53 v31.24,32.89 28.83,35.31 28.83,44.07 31.88,47.12 PC3.4 34.16,49.4 U3.12
  Bottom 0.254: U3.34 64.9,29.34 56.9,29.34 54.99,31.24 36.34,31.24 34.69,32.89 v31.24,32.89
PB4/MISO  (via drill 0.3 pad 0.64)
  Top 0.254: U1.16 31.21,32.03 v29.72,33.53 28.32,34.93 28.32,44.26 30.61,46.55 PC3.5 31.62,49.4 U3.13
  Bottom 0.254: v29.72,33.53 35.05,33.53 36.7,31.88 55.25,31.88 57.15,29.97 62.99,29.97 U3.38
PB5/SCK  (via drill 0.3 pad 0.64)
  Top 0.254: U1.17 v35.05,31.43 30.92,31.43 27.81,34.54 27.81,48.13 PC3.6 29.08,49.4 U3.14 | v10.29,43.31 4.06,43.31 R19.1
  Bottom 0.254: v35.05,31.43 35.88,30.61 54.74,30.61 56.64,28.7 62.99,28.7 U3.37 | PC3.6 26.8,47.12 17.91,47.12 14.1,43.31 v10.29,43.31
PC0
  Top 0.254: U1.23 39.5,31.41 39.5,30.86 39.75,30.61 42.91,30.61 50.93,22.59 PC2.1 U3.19
PC1
  Top 0.254: U1.24 42.91,31.43 51.44,22.9 51.44,7.24 PC2.2 U3.20
PC2
  Top 0.254: U1.25 43.12,32.03 51.94,23.21 51.94,9.27 PC2.3 U3.21
PC3
  Top 0.254: U3.22 PC2.4 52.45,11.3 52.45,23.47 43.39,32.53 U1.26
PC4/SDA  (via drill 0.3 pad 0.64)
  Top 0.254: v33.78,29.97 30.86,29.97 26.8,34.04 26.8,43.94 23.62,47.12 21.72,47.12 PC3.9 21.46,49.4 U3.17 | U3.23 PC2.5 56.01,10.29 56.01,15.73 I2C.2 52.96,18.78 52.96,23.88 v47.5,29.34 43.8,33.03 U1.27
  Bottom 0.254: v47.5,29.34 34.42,29.34 v33.78,29.97
PC5/SCL  (via drill 0.3 pad 0.64)
  Top 0.254: v33.15,29.34 30.86,29.34 26.29,33.91 26.29,43.82 23.49,46.61 19.68,46.61 PC3.10 18.92,49.4 U3.18 | U3.24 PC2.6 56.64,12.19 56.64,17.1 I2C.1 53.47,20.27 53.47,24.26 49.53,28.19 v49.02,28.7 44.19,33.53 U1.28
  Bottom 0.254: v33.15,29.34 33.78,28.7 v49.02,28.7
PD0/RX  (via drill 0.3 pad 0.64)
  Top 0.254: U3.1 PC4.1 62.99,48.39 61.72,47.12 v61.72,45.85 v61.72,31.88 61.72,21.54 UART.1 | U1.30 55.77,34.53 58.42,31.88 v60.45,31.88 | R7.2 v18.67,45.21
  Bottom 0.254: v60.45,31.88 v61.72,31.88 | v61.72,45.85 19.3,45.85 v18.67,45.21
PD1/TX  (via drill 0.3 pad 0.64)
  Top 0.254: 61.09,32.51 v61.09,45.21 PC4.2 U3.2 | 61.09,32.51 61.09,20.18 UART.2 | U1.31 56.03,35.03 58.55,32.51 61.09,32.51 | R15.2 v20.19,45.21
  Bottom 0.254: v61.09,45.21 v20.19,45.21
PD2/INT0
  Top 0.254: U3.3 PC4.3 45.69,35.53 U1.32
PD3/INT1
  Top 0.254: U3.4 PC4.4 56.01,46.48 45.66,36.13 U1.1
PD4
  Top 0.254: U1.2 39.48,36.68 39.75,36.96 45.85,36.96 53.47,44.58 PC4.5 U3.5
PD5
  Top 0.254: U1.9 33.3,35.53 31.88,36.96 31.88,42.55 33.91,44.58 47.12,44.58 PC4.6 U3.6
PD6
  Top 0.254: U1.10 33.04,35.03 31.37,36.7 31.37,42.8 33.66,45.09 45.09,45.09 PC4.7 U3.7
PD7
  Top 0.254: U1.11 32.78,34.53 30.86,36.45 30.86,43.05 33.4,45.59 43.05,45.59 PC4.8 U3.8
PWR_IN
  Top 1.27: C5.1 37.87,17.14 arc-45 38.05,17.07 38.1,17.02 arc-45 38.16,16.86 C22.+ 38.16,14.67 37.08,13.59 L1.2
  pour Top (isolate 0.152, rank 2, no thermals): 32.58,18.22 36.45,18.22 arc-90 37.08,17.59 37.08,16.64 34.8,16.64 arc-90 34.16,17.27 34.16,17.65 arc90 33.91,17.91 32.58,17.91
RES  (via drill 0.3 pad 0.64)
  Top 0.203: U5.24 14.32,35.21 11.68,37.85 11.68,43.18 v10.92,43.94
  Top 0.254: U5.24 14.82,32.8 D2.+ 15.62,32 R25.1
  Bottom 0.203: ICSP.3 10.29,50.04 10.29,44.58 v10.92,43.94
RESET  (via drill 0.3 pad 0.64)
  Top 0.254: R5.2 22.73,6.98 22.73,6.86 | U3.36 62.36,26.8 v62.36,32.51 v62.36,46.48 | U1.29 55.5,34.03 58.29,31.24 v59.82,31.24 | RST.- 15.24,3.68 SW1.1 17.65,3.81 19.18,5.33 21.21,5.33 22.73,6.86 | 22.73,6.86 23.62,7.75 30.61,7.75 PC1.6 U3.30 34.42,1.4 v49.02,1.4 | C14.2 v17.14,45.21 15.49,45.21 15.37,45.09 D3.+
  Bottom 0.254: v59.82,31.24 61.98,31.24 62.36,31.62 v62.36,32.51 | v49.02,1.4 49.02,22.35 52.2,25.53 U3.36 | v62.36,46.48 18.41,46.48 v17.14,45.21
SCK
  Top 0.203: U5.15 16.02,39.73 15.49,40.26 14.73,40.26 14.35,40.64 14.35,44.96 12.7,46.61 12.7,47.62 ICSP.2
USB5V  (via drill 0.3 pad 0.64)
  Top 0.203: U5.31 18.52,34.06 v18.92,33.66 19.43,33.66 20.19,32.89 C13.2
  Top 0.254: USB.1 5.18,31.91 5.21,31.88 5.21,32.13 | v12.19,32.51 9.65,32.51 C10.2
  Top 0.305: v7.49,34.42 7.49,33.27
  Top 0.406: Q16.3 8.89,35.69
  Top 0.813: 5.21,32.13 6.35,32.13 7.49,33.27 C10.2 8.89,35.69
  Bottom 0.305: v7.49,34.42 U5V.T
  Bottom 0.406: v18.92,33.66 18.92,34.04 18.67,34.29 18.54,34.42 16.64,34.42 14.73,32.51 v12.19,32.51
VCC  (via drill 0.3 pad 0.64)
  Top 0.254: R10.2 R9.2 4.83,40.77 v9.4,40.77 | C24.2 20.83,39.12 20.83,37.08 v20.45,36.7 v20.44,36.71 U5.4 | C23.2 20.45,33.27 v20.45,34.42 19.11,34.42 U5.32
  Top 0.305: U1.4 38.48,36.71 | 38.48,36.71 38.48,36.96 | 38.48,36.96 38.48,37.08 | 38.48,37.08 C41.2 | U1.6 37.48,36.72 37.72,36.96 38.23,36.96 | 38.35,36.96 38.48,36.96 | 38.23,36.96 38.35,36.96 | 38.35,36.96 38.48,37.08 | 38.48,36.71 38.23,36.96 | U1.18 36.98,29.74 C11.2
  Top 0.406: R3.1 23.11,8.51 | 23.11,8.51 R5.1 v22.1,8.51 | v22.1,8.51 R4.1 | v22.1,8.51 22.99,8.51 23.11,8.38 23.11,8.51
  Top 0.61: 20.57,26.29 R6.1 30.73,26.29 32.39,27.94 35.43,27.94 36.45,28.96 C11.2 | 20.57,26.29 C3.1 20.32,26.42 | 3.56,37.72 R10.2 | C41.2 v39.62,39.12 | R25.2 16.89,30.48 15.75,29.34 | 15.75,29.34 D2.- 16.89,27.43 16.89,26.42 Q3.2 17.14,26.29 C9.2 v19.37,26.29 20.57,26.29 | v16.38,40.26 16.38,40.64 D3.- | 15.75,29.34 15.75,29.08 13.21,26.54 Q4.3
  Bottom 0.254: 20.45,36.07 v20.45,36.7
  Bottom 0.61: I2C.3 54.75,14.99 54.86,14.99 54.88,15 UART.3 67.56,18.3 67.56,29.21 U3.33 62.99,33.78 J3.1 59.69,33.78 | v22.1,8.51 18.92,11.68 18.92,25.84 v19.37,26.29 20.45,27.37 v20.45,34.42 20.45,36.07 v20.45,36.7 20.45,39.88 | 59.56,33.78 59.69,33.78 | 59.69,33.78 50.93,42.55 40.01,42.55 | 40.01,42.55 39.62,42.55 | 39.62,42.55 39.24,42.55 | 20.45,39.88 23.11,42.55 39.24,42.55 | v39.62,39.12 39.62,42.16 | 39.62,42.16 39.62,42.55 | 39.24,42.55 39.62,42.16 | 39.62,42.16 40.01,42.55 | ICSP.6 9.27,40.89 v9.4,40.77 10.41,39.75 16.38,39.75 | v16.38,40.26 16.38,39.75 | 16.38,39.75 20.32,39.75 20.45,39.88
XTAL1
  Top 0.254: U1.7 36.98,37.83 C6.2 36.58,39.37 X1.2
XTAL2
  Top 0.254: U1.8 36.48,36.8 C8.2 35.05,39.37 X1.1
XTAL11
  Top 0.254: U5.2 20.59,35.71 C12.2 22.92,36.83 X2.2
XTAL21
  Top 0.254: U5.1 21.69,35.21 C27.2 22.92,35.18 X2.1

### Text on the board
tPlace: TX | RX | 13 | 12 | 11 | 10 | 9 | 8 | 7 | 6 | 5 | 4 | 3 | 2 | 1 | 0 | SCL | SDA | AREF | GND | ~ | ~ | ~ | ~ | ~ | ~ | DIGITAL | GND | RTS | TX | RX | VCC | seeed.cc | MISO | VCC | SCK | MOSI | RST | GND | SCL | RX | SDA | TX | 5V <VCC> 3V3 | VCC | VCC | GND | GND | POWER | ANALOG | NC | IOREF | RST | 3V3 | 5V | GND | GND | VIN | 0 | 1 | 2 | 3 | 4 | 5
bPlace: Seeeduino | v4.0 07/30/2014 | by Seeed Studio | www.seeedstudio.com | DC 7-15V